# Altium schematic sheet borda_sch.SchDoc
size A4; SheetNumber: 1; SheetTotal: 1
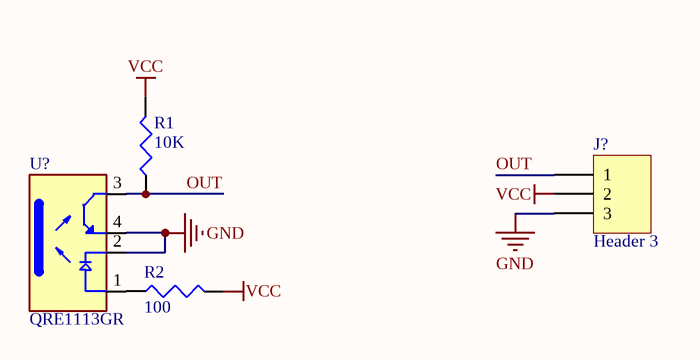
[diagram p0: borda_sch.SchDoc]

## Parts
J?  Header 3  [HDR1X3 THT]
R1  value 10K  [Resistor SMD 0603]  (hidden comment: Resistor SMD)
R2  value 100  [Resistor SMD 0603]  (hidden comment: Resistor SMD)
U?  QRE1113GR  [SOIC180P460X187-4N]

## Nets
GND: J?.3 U?.2(C) U?.4(ET)
VCC: J?.2 R1.2 R2.2
OUT: J?.1 R1.1 U?.3(CT)
NetR2_1: R2.1 U?.1(A)

## Library data of the parts
J? = Header 3: Header, 3-Pin; LatestRevisionDate: 17-Jul-2002; LatestRevisionNote: Re-released for DXP Platform.; Publisher: Altium Limited
R1 R2 = Resistor SMD: Resistor SMD com os tamanhos 0603, 0805, 1206 e 1210; Size: 0603
U? = QRE1113GR: Reflective Optical Sensor 0.039 (1mm) 4-SMD, Gull Wing; MF: ON Semiconductor; Package: ARUSM-313-4 ON Semiconductor; Price: None; Check_prices: https://www.snapeda.com/parts/QRE1113GR/Onsemi/view-part/?ref=eda; Value: *; SnapEDA_Link: https://www.snapeda.com/parts/QRE1113GR/Onsemi/view-part/?ref=snap; MP: QRE1113GR; Availability: In Stock; Purchase-URL: https://pricing.snapeda.com/search/part/QRE1113GR/?ref=eda